# Altium schematic sheet 4-RELAYS.SchDoc
size 420 x 297 mm; Engineer: Иванов; DocumentNumber: GPIO; SheetNumber: 4; SheetTotal: 4
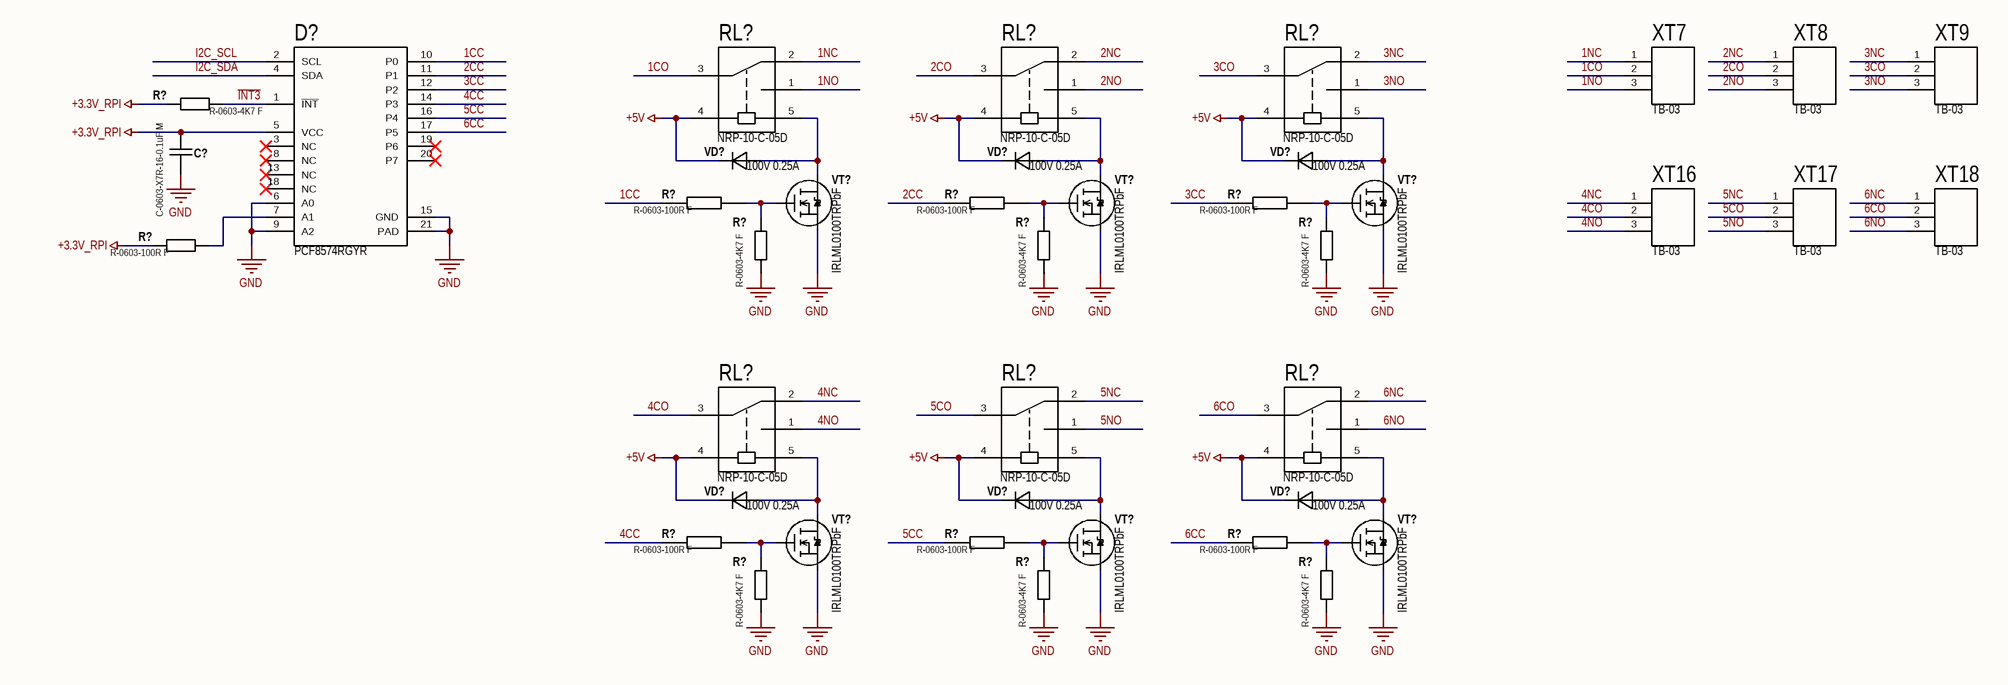
[diagram p0: 4-RELAYS.SchDoc]

## Parts
(Parts that share a designator on the sheet are numbered #1, #2 ... from top to bottom, then left to right.)
C?  C-0603-X7R-16-0.1uF M  [CAPC160X80X100L35N]
D?  PCF8574RGYR
R?#1  R-0603-4K7 F  [RESC160X80X55L30N]
R?#2  R-0603-100R F  [RESC160X80X55L30N]
R?#3  R-0603-100R F  [RESC160X80X55L30N]
R?#4  R-0603-100R F  [RESC160X80X55L30N]
R?#5  R-0603-100R F  [RESC160X80X55L30N]
R?#6  R-0603-4K7 F  [RESC160X80X55L30N]
R?#7  R-0603-4K7 F  [RESC160X80X55L30N]
R?#8  R-0603-4K7 F  [RESC160X80X55L30N]
R?#9  R-0603-100R F  [RESC160X80X55L30N]
R?#10  R-0603-100R F  [RESC160X80X55L30N]
R?#11  R-0603-100R F  [RESC160X80X55L30N]
R?#12  R-0603-4K7 F  [RESC160X80X55L30N]
R?#13  R-0603-4K7 F  [RESC160X80X55L30N]
R?#14  R-0603-4K7 F  [RESC160X80X55L30N]
RL?#1  NRP-10-C-05D
RL?#2  NRP-10-C-05D
RL?#3  NRP-10-C-05D
RL?#4  NRP-10-C-05D
RL?#5  NRP-10-C-05D
RL?#6  NRP-10-C-05D
VD?#1  value 100V 0.25A  (hidden comment: BAS16J,115)
VD?#2  value 100V 0.25A  (hidden comment: BAS16J,115)
VD?#3  value 100V 0.25A  (hidden comment: BAS16J,115)
VD?#4  value 100V 0.25A  (hidden comment: BAS16J,115)
VD?#5  value 100V 0.25A  (hidden comment: BAS16J,115)
VD?#6  value 100V 0.25A  (hidden comment: BAS16J,115)
VT?#1  IRLML0100TRPbF
VT?#2  IRLML0100TRPbF
VT?#3  IRLML0100TRPbF
VT?#4  IRLML0100TRPbF
VT?#5  IRLML0100TRPbF
VT?#6  IRLML0100TRPbF
XT7  TB-03  [HDRV3W63P254_3X1_762X571H1144]
XT8  TB-03  [HDRV3W63P254_3X1_762X571H1144]
XT9  TB-03  [HDRV3W63P254_3X1_762X571H1144]
XT16  TB-03  [HDRV3W63P254_3X1_762X571H1144]
XT17  TB-03  [HDRV3W63P254_3X1_762X571H1144]
XT18  TB-03  [HDRV3W63P254_3X1_762X571H1144]

## Nets
+3.3V_RPI: C?.1 D?.5(VCC) R?#1.2 R?#5.2
+5V: RL?#1.4(C+) RL?#2.4(C+) RL?#3.4(C+) RL?#4.4(C+) RL?#5.4(C+) RL?#6.4(C+) VD?#1.3(C) VD?#2.3(C) VD?#3.3(C) VD?#4.3(C) VD?#5.3(C) VD?#6.3(C)
GND: C?.2 D?.6(A0) D?.9(A2) D?.15(GND) D?.21(PAD) R?#6.1 R?#7.1 R?#8.1 R?#12.1 R?#13.1 R?#14.1 VT?#1.2(S) VT?#2.2(S) VT?#3.2(S) VT?#4.2(S) VT?#5.2(S) VT?#6.2(S)
1CC: D?.10(P0) R?#2.2
1CO: RL?#1.3(CO) XT7.2
1NC: RL?#1.2(NC) XT7.1
1NO: RL?#1.1(NO) XT7.3
2CC: D?.11(P1) R?#3.2
2CO: RL?#2.3(CO) XT8.2
2NC: RL?#2.2(NC) XT8.1
2NO: RL?#2.1(NO) XT8.3
3CC: D?.12(P2) R?#4.2
3CO: RL?#3.3(CO) XT9.2
3NC: RL?#3.2(NC) XT9.1
3NO: RL?#3.1(NO) XT9.3
4CC: D?.14(P3) R?#9.2
4CO: RL?#4.3(CO) XT16.2
4NC: RL?#4.2(NC) XT16.1
4NO: RL?#4.1(NO) XT16.3
5CC: D?.16(P4) R?#10.2
5CO: RL?#5.3(CO) XT17.2
5NC: RL?#5.2(NC) XT17.1
5NO: RL?#5.1(NO) XT17.3
6CC: D?.17(P5) R?#11.2
6CO: RL?#6.3(CO) XT18.2
6NC: RL?#6.2(NC) XT18.1
6NO: RL?#6.1(NO) XT18.3
I2C_SCL: D?.2(SCL)
I2C_SDA: D?.4(SDA)
~{INT3}: D?.1(~{INT}) R?#1.1
NetD?_7: D?.7(A1) R?#5.1
NetR?#2_1: R?#2.1 R?#6.2 VT?#1.1(G)
NetR?#3_1: R?#3.1 R?#7.2 VT?#2.1(G)
NetR?#4_1: R?#4.1 R?#8.2 VT?#3.1(G)
NetR?#9_1: R?#9.1 R?#12.2 VT?#4.1(G)
NetR?#10_1: R?#10.1 R?#13.2 VT?#5.1(G)
NetR?#11_1: R?#11.1 R?#14.2 VT?#6.1(G)
NetRL?#1_5: RL?#1.5(C-) VD?#1.1(A) VT?#1.3(D)
NetRL?#2_5: RL?#2.5(C-) VD?#2.1(A) VT?#2.3(D)
NetRL?#3_5: RL?#3.5(C-) VD?#3.1(A) VT?#3.3(D)
NetRL?#4_5: RL?#4.5(C-) VD?#4.1(A) VT?#4.3(D)
NetRL?#5_5: RL?#5.5(C-) VD?#5.1(A) VT?#5.3(D)
NetRL?#6_5: RL?#6.5(C-) VD?#6.1(A) VT?#6.3(D)

Not connected (* = marked no-connect by the designer): D? 3(NC)* 8(NC)* 13(NC)* 18(NC)* 19(P6)* 20(P7)*

## Notes on the sheet
- Подп. и дата
- Инв.№ дубл.
- Взам.инв.№
- Подп.и дата
- Инв.№ подл.
- Изм.
- Лист
- № докум.
- Подп.
- Дата
- Копировал
- Формат  A3

## Library data of the parts
C? = C: General capacitor; Manufacturer: Murata; Component_Type: Конденсатор; Mount_Type: SMD; Tolerance: 20%; Voltage: 16V; Value: 0.1uF; TC: X7R; Partnumber: *; PnP_Name: C-0603-X7R-16-0.1uF M; Size: 0603; UID: C-0603-X7R-16-0.1uF M
D? = PCF8574RGYR: PCF8574 Remote 8-Bit I/O Expander for I2C Bus; Manufacturer: Texas Instruments; Component_Type: Микросхема; Mount_Type: Auto; PnP_Name: D-PCF8574RGYR; Partnumber: PCF8574RGYR; UID: D-PCF8574RGYR
R?#1 R?#6-R?#8 R?#12-R?#14 = R: General resistor; Manufacturer: Yageo; Mount_Type: Auto; Component_Type: Резистор; Tolerance: 1%; Value: 4.7k; Partnumber: *; Size: 0603; PnP_Name: R-0603-4K7 F; UID: R-0603-4K7 F; TC: -
R?#2-R?#4 R?#9-R?#11 = R: General resistor; Manufacturer: Yageo; Mount_Type: SMD; Component_Type: Резистор; Value: 100; Partnumber: *; Tolerance: -; Size: 0603; PnP_Name: R-0603-100R F; UID: R-0603-100R F
R?#5 = R: General resistor; Manufacturer: Yageo; Mount_Type: Auto; Component_Type: Резистор; Tolerance: 1%; Value: 100; Partnumber: *; Size: 0603; PnP_Name: R-0603-100R F; UID: R-0603-100R F; TC: -
RL?#1-RL?#6 = NRP-10-C-05D: Relay; Manufacturer: NCR; Component_Type: Реле; Mount_Type: Manual; UID: RL-NRP-10-C-05D; Partnumber: NRP-10-C-05D
VD?#1-VD?#6 = BAS16J_115: Zener Voltage Regulator (Diod); Manufacturer: Nexperia; Component_Type: Транзистор; Mount_Type: Auto; PnP_Name: VD-BAS16J115; Partnumber: BAS16J,115; UID: VD-BAS16J115
VT?#1-VT?#6 = IRLML0100TRPbF: N-MOSFET; Manufacturer: Vishay; Component_Type: Транзистор; Mount_Type: Auto; PnP_Name: VT-IRLML0100TRPbF; Value: 100V 1.6A; Partnumber: IRLML0100TRPbF; UID: VT-IRLML0100TRPbF
XT7-XT9 XT16-XT18 = Conn_3: Manufacturer: KLS; Component_Type: Клеммник; Mount_Type: Manual; Partnumber: TB-03; UID: X-TB-03